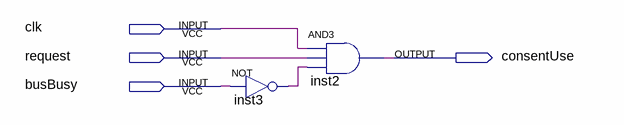
[diagram p0: schematic sheet]
// Quartus schematic Arbitr.bdf as structural Verilog: 2 symbols, 4 pins
module Arbitr (
  input  clk,
  input  request,
  input  busBusy,
  output consentUse
);

  wire inst3_out;

  not inst3 (inst3_out, busBusy);
  and inst2 (consentUse, clk, request, inst3_out);
endmodule
